# Altium schematic sheet ZynqEMIO_Bank34.SchDoc: =TITLE
size A3
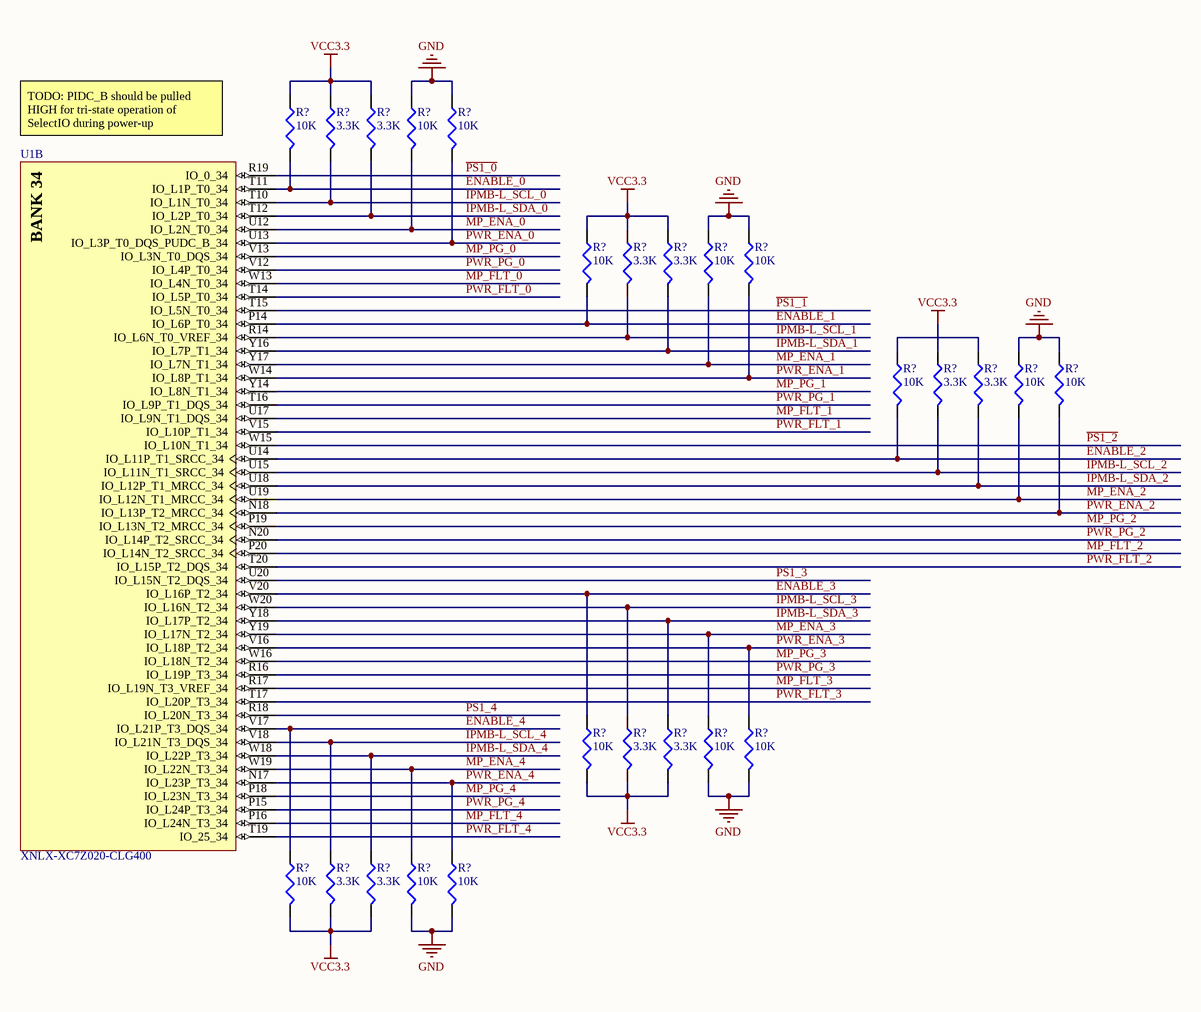
[diagram p0: ZynqEMIO_Bank34.SchDoc]

## Parts
(Parts that share a designator on the sheet are numbered #1, #2 ... from top to bottom, then left to right.)
R?#1  value 10K  [R0201]  (hidden comment: ?)
R?#2  value 3.3K  [R0201]  (hidden comment: ?)
R?#3  value 3.3K  [R0201]  (hidden comment: ?)
R?#4  value 10K  [R0201]  (hidden comment: ?)
R?#5  value 10K  [R0201]  (hidden comment: ?)
R?#6  value 10K  [R0201]  (hidden comment: ?)
R?#7  value 3.3K  [R0201]  (hidden comment: ?)
R?#8  value 3.3K  [R0201]  (hidden comment: ?)
R?#9  value 10K  [R0201]  (hidden comment: ?)
R?#10  value 10K  [R0201]  (hidden comment: ?)
R?#11  value 10K  [R0201]  (hidden comment: ?)
R?#12  value 3.3K  [R0201]  (hidden comment: ?)
R?#13  value 3.3K  [R0201]  (hidden comment: ?)
R?#14  value 10K  [R0201]  (hidden comment: ?)
R?#15  value 10K  [R0201]  (hidden comment: ?)
R?#16  value 10K  [R0201]  (hidden comment: ?)
R?#17  value 3.3K  [R0201]  (hidden comment: ?)
R?#18  value 3.3K  [R0201]  (hidden comment: ?)
R?#19  value 10K  [R0201]  (hidden comment: ?)
R?#20  value 10K  [R0201]  (hidden comment: ?)
R?#21  value 10K  [R0201]  (hidden comment: ?)
R?#22  value 3.3K  [R0201]  (hidden comment: ?)
R?#23  value 3.3K  [R0201]  (hidden comment: ?)
R?#24  value 10K  [R0201]  (hidden comment: ?)
R?#25  value 10K  [R0201]  (hidden comment: ?)
U1  XNLX-XC7Z020-CLG400  [CLG400]  (part B of 9)

## Nets
GND: R?#4.1 R?#5.1 R?#9.1 R?#10.1 R?#14.1 R?#15.1 R?#19.1 R?#20.1 R?#24.1 R?#25.1
VCC3.3: R?#1.1 R?#2.1 R?#3.1 R?#6.1 R?#7.1 R?#8.1 R?#12.1 R?#16.1 R?#17.1 R?#18.1 R?#21.1 R?#22.1 R?#23.1
~{ENABLE_0}: R?#1.2 U1.T11(IO_L1P_T0_34)
~{ENABLE_1}: R?#6.2 U1.P14(IO_L6P_T0_34)
~{ENABLE_2}: R?#11.2 U1.U14(IO_L11P_T1_SRCC_34)
~{ENABLE_3}: R?#16.2 U1.V20(IO_L16P_T2_34)
~{ENABLE_4}: R?#21.2 U1.V17(IO_L21P_T3_DQS_34)
~{PS1_0}: U1.R19(IO_0_34)
~{PS1_1}: U1.T15(IO_L5N_T0_34)
~{PS1_2}: U1.W15(IO_L10N_T1_34)
~{PS1_3}: U1.U20(IO_L15N_T2_DQS_34)
~{PS1_4}: U1.R18(IO_L20N_T3_34)
IPMB-L_SCL_0: R?#2.2 U1.T10(IO_L1N_T0_34)
IPMB-L_SCL_1: R?#7.2 U1.R14(IO_L6N_T0_VREF_34)
IPMB-L_SCL_2: R?#12.2 U1.U15(IO_L11N_T1_SRCC_34)
IPMB-L_SCL_3: R?#17.2 U1.W20(IO_L16N_T2_34)
IPMB-L_SCL_4: R?#22.2 U1.V18(IO_L21N_T3_DQS_34)
IPMB-L_SDA_0: R?#3.2 U1.T12(IO_L2P_T0_34)
IPMB-L_SDA_1: R?#8.2 U1.Y16(IO_L7P_T1_34)
IPMB-L_SDA_2: R?#13.2 U1.U18(IO_L12P_T1_MRCC_34)
IPMB-L_SDA_3: R?#18.2 U1.Y18(IO_L17P_T2_34)
IPMB-L_SDA_4: R?#23.2 U1.W18(IO_L22P_T3_34)
MP_ENA_0: R?#4.2 U1.U12(IO_L2N_T0_34)
MP_ENA_1: R?#9.2 U1.Y17(IO_L7N_T1_34)
MP_ENA_2: R?#14.2 U1.U19(IO_L12N_T1_MRCC_34)
MP_ENA_3: R?#19.2 U1.Y19(IO_L17N_T2_34)
MP_ENA_4: R?#24.2 U1.W19(IO_L22N_T3_34)
MP_FLT_0: U1.W13(IO_L4N_T0_34)
MP_FLT_1: U1.U17(IO_L9N_T1_DQS_34)
MP_FLT_2: U1.P20(IO_L14N_T2_SRCC_34)
MP_FLT_3: U1.R17(IO_L19N_T3_VREF_34)
MP_FLT_4: U1.P16(IO_L24N_T3_34)
MP_PG_0: U1.V13(IO_L3N_T0_DQS_34)
MP_PG_1: U1.Y14(IO_L8N_T1_34)
MP_PG_2: U1.P19(IO_L13N_T2_MRCC_34)
MP_PG_3: U1.W16(IO_L18N_T2_34)
MP_PG_4: U1.P18(IO_L23N_T3_34)
PWR_ENA_0: R?#5.2 U1.U13(IO_L3P_T0_DQS_PUDC_B_34)
PWR_ENA_1: R?#10.2 U1.W14(IO_L8P_T1_34)
PWR_ENA_2: R?#15.2 U1.N18(IO_L13P_T2_MRCC_34)
PWR_ENA_3: R?#20.2 U1.V16(IO_L18P_T2_34)
PWR_ENA_4: R?#25.2 U1.N17(IO_L23P_T3_34)
PWR_FLT_0: U1.T14(IO_L5P_T0_34)
PWR_FLT_1: U1.V15(IO_L10P_T1_34)
PWR_FLT_2: U1.T20(IO_L15P_T2_DQS_34)
PWR_FLT_3: U1.T17(IO_L20P_T3_34)
PWR_FLT_4: U1.T19(IO_25_34)
PWR_PG_0: U1.V12(IO_L4P_T0_34)
PWR_PG_1: U1.T16(IO_L9P_T1_DQS_34)
PWR_PG_2: U1.N20(IO_L14P_T2_SRCC_34)
PWR_PG_3: U1.R16(IO_L19P_T3_34)
PWR_PG_4: U1.P15(IO_L24P_T3_34)
NetR?#11_1: R?#11.1 R?#13.1

## Notes on the sheet
- TODO: PIDC_B should be pulled HIGH for tri-state operation of SelectIO during power-up
- Description
- Title
- Size:
- Date:
- A3
- Number:
- Time:
- Revision:
- Sheet
- of
- File:
- Author:
- (in symbol XNLX-XC7Z020-CLG400, part B) BANK 34

## Library data of the parts
R?#1-R?#25 = Res: Resistor; Tolerance: 5%; PackageDescription: Chip Resistor